# Altium schematic sheet PL_DDR_Power.SchDoc: PL_DDR_Power
size A4; Author: Carlos Barreiro; Organization: Escuela Técnica Superior de Ingeniería de Sistemas Informáticos de la Universidad Politécnica de Madrid; Address1: Campus Sur de la Universidad Politécnica de Madrid; Address2: Calle de Alan Turing, s/nº; Address3: Madrid 28031; Address4: España; DocumentNumber: 9; Revision: A; SheetNumber: 9; SheetTotal: 12
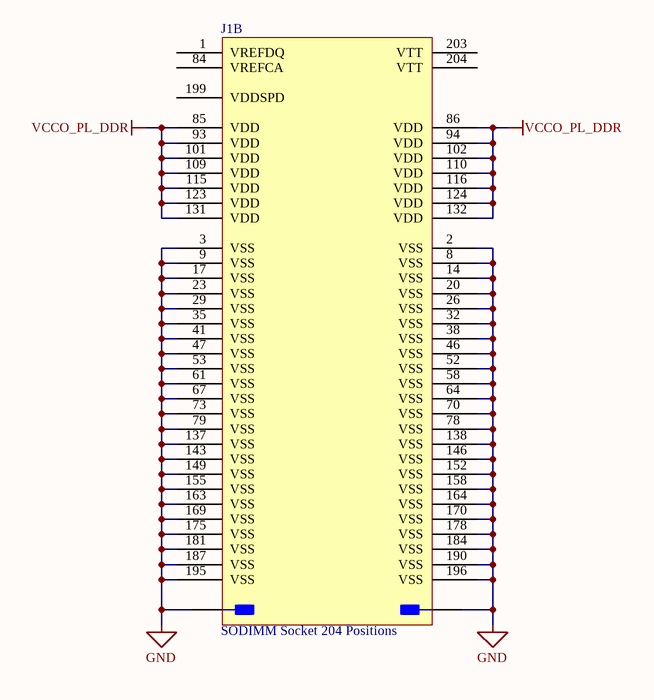
[diagram p0: PL_DDR_Power.SchDoc]

## Parts
J1  SODIMM Socket 204 Positions  [TE_DDR3_SODIMM_RA_Socket]  (part B of 2)

## Nets
GND: J1.2(VSS) J1.3(VSS) J1.8(VSS) J1.9(VSS) J1.14(VSS) J1.17(VSS) J1.20(VSS) J1.23(VSS) J1.26(VSS) J1.29(VSS) J1.32(VSS) J1.35(VSS) J1.38(VSS) J1.41(VSS) J1.46(VSS) J1.47(VSS) J1.52(VSS) J1.53(VSS) J1.58(VSS) J1.61(VSS) J1.64(VSS) J1.67(VSS) J1.70(VSS) J1.73(VSS) J1.78(VSS) J1.79(VSS) J1.137(VSS) J1.138(VSS) J1.143(VSS) J1.146(VSS) J1.149(VSS) J1.152(VSS) J1.155(VSS) J1.158(VSS) J1.163(VSS) J1.164(VSS) J1.169(VSS) J1.170(VSS) J1.175(VSS) J1.178(VSS) J1.181(VSS) J1.184(VSS) J1.187(VSS) J1.190(VSS) J1.195(VSS) J1.196(VSS) J1.205(GND) J1.206(GND)
VCCO_PL_DDR: J1.85(VDD) J1.86(VDD) J1.93(VDD) J1.94(VDD) J1.101(VDD) J1.102(VDD) J1.109(VDD) J1.110(VDD) J1.115(VDD) J1.116(VDD) J1.123(VDD) J1.124(VDD) J1.131(VDD) J1.132(VDD)

Not connected (* = marked no-connect by the designer): J1 1(VREFDQ) 84(VREFCA) 199(VDDSPD) 203(VTT) 204(VTT)

## Notes on the sheet
- Project:
- Title:
- Date:
- Designer:
- Sheet
- Revision:
- of
- Commit:

## Library data of the parts
J1 = 2-2013310-1: Connector SODIMM Socket 204 Positions, Right Angle, DDR3/DDR3L +1.5V +1.35V; Memory Type: DDR3, DDR3L, SDRAM; Number of Positions: 204; JEDEC Standard: 204-Pin EP3-6400/EP3-8500/EP3-10600/EP3-12800 DDR3 SDRAM 72b-S0-DIMM Design Specification; Number of Rows: 2; Orientation: Right Angle; Packaging: Tape & Reel (TR); Termination: Solder; Radiation Hardening: No; Form Factor: SODIMM; ComponentLink1Description: Manufacturer; ComponentLink1URL: https://www.te.com/usa-en/product-2-2013310-1.html?te_bu=Cor&te_type=other&te_campaign=oct_glo_manufacturer&elqCampaignId=26136; ComponentLink2Description: Pinout; ComponentLink2URL: https://media-www.micron.com/-/media/client/global/documents/products/data-sheet/modules/sodimm/jtf16c256_512_1gx64hz.pdf?rev=92a9360308b84bd182ce55b117fec160; Supplier 1: RSComponents; Supplier 2: Mouser; Supplier 3: Digi-Key; Supplier Part Number 1: 9097429; Supplier Part Number 2: 571-2-2013310-1; Supplier Part Number 3: A111121CT-ND